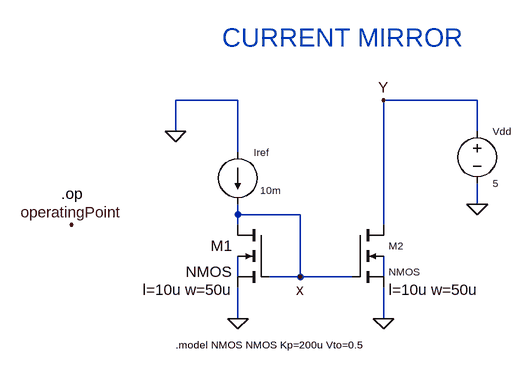
[diagram p0: schematic 11)current_mirror.asc]
11)current_mirror.asc, the LTspice schematic file:
Version 4
SHEET 1 880 680
WIRE 80 -48 -16 -48
WIRE 448 -48 304 -48
WIRE -16 0 -16 -48
WIRE 448 0 448 -48
WIRE 80 32 80 -48
WIRE 448 112 448 80
WIRE 80 128 80 112
WIRE 176 128 80 128
WIRE 80 144 80 128
WIRE 304 144 304 -48
WIRE 80 224 80 192
WIRE 176 224 176 128
WIRE 176 224 128 224
WIRE 256 224 176 224
WIRE 304 224 304 192
WIRE 80 288 80 240
WIRE 304 288 304 240
FLAG 80 288 0
FLAG 304 288 0
FLAG -16 0 0
FLAG 448 112 0
FLAG 176 224 x
FLAG 304 -48 Y
FLAG -176 144 operatingPoint
SYMBOL current 80 32 R0
WINDOW 123 0 0 Left 0
WINDOW 39 0 0 Left 0
WINDOW 0 24 0 Left 1
WINDOW 3 34 59 Left 1
SYMATTR InstName Iref
SYMATTR Value 10m
SYMBOL voltage 448 -16 R0
WINDOW 123 0 0 Left 0
WINDOW 39 0 0 Left 0
WINDOW 0 24 16 Left 1
WINDOW 3 24 96 Left 1
SYMATTR InstName Vdd
SYMATTR Value 5
SYMBOL nmos4 256 144 R0
WINDOW 123 56 100 Left 2
WINDOW 0 56 32 Left 1
WINDOW 3 56 72 Left 1
SYMATTR Value2 l=10u w=50u
SYMATTR InstName M2
SYMBOL nmos4 128 144 M0
WINDOW 123 56 100 Left 2
SYMATTR Value2 l=10u w=50u
SYMATTR InstName M1
TEXT -16 328 Left 1 !.model NMOS NMOS Kp=200u Vto=0.5
TEXT -192 96 Left 2 !.op
TEXT 56 -144 Left 4 ;CURRENT MIRROR

The netlist it stands for:
* 11)current_mirror.asc
Iref 0 x 10m
Vdd Y 0 5
M2 Y x 0 N002 NMOS l=10u w=50u
M1 x x 0 N001 NMOS l=10u w=50u
.model NMOS NMOS
.model PMOS PMOS
.lib standard.mos
.model NMOS NMOS Kp=200u Vto=0.5
.op
* CURRENT MIRROR
.backanno
.end